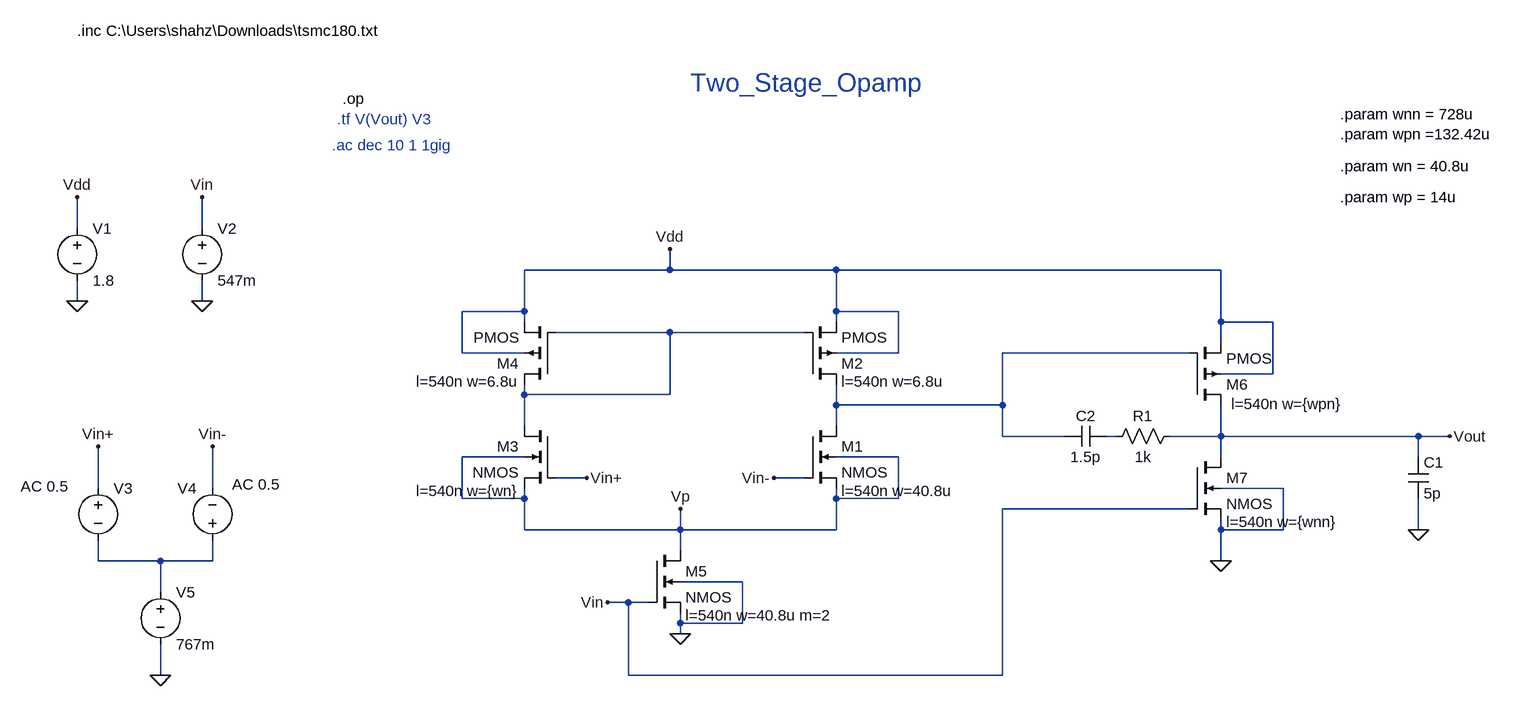
[diagram p0: schematic OpAmp_Core_Circuit.asc]
OpAmp_Core_Circuit.asc, the LTspice schematic file:
Version 4
SHEET 1 1876 936
WIRE -880 -96 -880 -144
WIRE -688 -96 -688 -144
WIRE 32 -32 32 -64
WIRE 32 -32 -192 -32
WIRE 288 -32 32 -32
WIRE 880 -32 288 -32
WIRE -880 16 -880 -16
WIRE -688 16 -688 -16
WIRE -192 32 -192 -32
WIRE -192 32 -288 32
WIRE 288 32 288 -32
WIRE 384 32 288 32
WIRE -192 48 -192 32
WIRE 288 48 288 32
WIRE 880 48 880 -32
WIRE 960 48 880 48
WIRE 32 64 -144 64
WIRE 240 64 32 64
WIRE 880 80 880 48
WIRE -288 96 -288 32
WIRE -192 96 -288 96
WIRE 384 96 384 32
WIRE 384 96 288 96
WIRE 832 96 544 96
WIRE 960 128 960 48
WIRE 960 128 880 128
WIRE -192 160 -192 144
WIRE 32 160 32 64
WIRE 32 160 -192 160
WIRE 288 176 288 144
WIRE 544 176 544 96
WIRE 544 176 288 176
WIRE -192 208 -192 160
WIRE 288 208 288 176
WIRE 544 224 544 176
WIRE 640 224 544 224
WIRE 720 224 704 224
WIRE 880 224 880 176
WIRE 880 224 800 224
WIRE 1184 224 880 224
WIRE 1232 224 1184 224
WIRE -192 256 -288 256
WIRE 384 256 288 256
WIRE 880 256 880 224
WIRE 1184 256 1184 224
WIRE -96 288 -144 288
WIRE 240 288 192 288
WIRE -848 304 -848 240
WIRE -672 304 -672 240
WIRE 976 304 880 304
WIRE -288 320 -288 256
WIRE -192 320 -192 304
WIRE -192 320 -288 320
WIRE 288 320 288 304
WIRE 384 320 384 256
WIRE 384 320 288 320
WIRE 832 336 544 336
WIRE -192 368 -192 320
WIRE 48 368 48 336
WIRE 48 368 -192 368
WIRE 288 368 288 320
WIRE 288 368 48 368
WIRE 880 368 880 352
WIRE 976 368 976 304
WIRE 976 368 880 368
WIRE 1184 368 1184 320
WIRE 48 400 48 368
WIRE -848 416 -848 384
WIRE -752 416 -848 416
WIRE -672 416 -672 384
WIRE -672 416 -752 416
WIRE 880 416 880 368
WIRE 144 448 48 448
WIRE -752 464 -752 416
WIRE -32 480 -64 480
WIRE 0 480 -32 480
WIRE 48 512 48 496
WIRE 144 512 144 448
WIRE 144 512 48 512
WIRE 48 528 48 512
WIRE -752 592 -752 544
WIRE -32 592 -32 480
WIRE 544 592 544 336
WIRE 544 592 -32 592
FLAG 32 -64 Vdd
FLAG 192 288 Vin-
FLAG -96 288 Vin+
FLAG -880 16 0
FLAG -880 -144 Vdd
FLAG -688 16 0
FLAG -688 -144 Vin
FLAG 48 528 0
FLAG -64 480 Vin
FLAG -752 592 0
FLAG -848 240 Vin+
FLAG -672 240 Vin-
FLAG 48 336 Vp
FLAG 880 416 0
FLAG 1232 224 Vout
FLAG 1184 368 0
DATAFLAG 992 224 ""
DATAFLAG 416 176 ""
SYMBOL nmos4 240 208 R0
WINDOW 123 56 100 Left 2
SYMATTR Value2 l=540n w=40.8u
SYMATTR InstName M1
SYMBOL pmos4 240 144 M180
WINDOW 123 56 4 Left 2
SYMATTR Value2 l=540n w=6.8u
SYMATTR InstName M2
SYMBOL nmos4 -144 208 M0
WINDOW 123 56 100 Left 2
SYMATTR Value2 l=540n w={wn}
SYMATTR InstName M3
SYMBOL pmos4 -144 144 R180
WINDOW 123 56 4 Left 2
SYMATTR Value2 l=540n w=6.8u
SYMATTR InstName M4
SYMBOL voltage -880 -112 R0
WINDOW 123 0 0 Left 0
WINDOW 39 0 0 Left 0
SYMATTR InstName V1
SYMATTR Value 1.8
SYMBOL voltage -688 -112 R0
WINDOW 123 24 124 Left 2
WINDOW 39 0 0 Left 0
SYMATTR InstName V2
SYMATTR Value 547m
SYMBOL nmos4 0 400 R0
WINDOW 123 56 100 Left 2
SYMATTR Value2 l=540n w=40.8u m=2
SYMATTR InstName M5
SYMBOL voltage -848 288 R0
WINDOW 123 -119 13 Left 2
WINDOW 39 0 0 Left 0
SYMATTR Value2 AC 0.5
SYMATTR InstName V3
SYMATTR Value ""
SYMBOL voltage -672 400 R180
WINDOW 0 24 96 Left 2
WINDOW 3 24 16 Left 2
WINDOW 123 -104 102 Left 2
WINDOW 39 0 0 Left 0
SYMATTR InstName V4
SYMATTR Value ""
SYMATTR Value2 AC 0.5
SYMBOL voltage -752 448 R0
WINDOW 123 0 0 Left 0
WINDOW 39 0 0 Left 0
SYMATTR InstName V5
SYMATTR Value 767m
SYMBOL pmos4 832 176 M180
WINDOW 123 64 2 Left 2
SYMATTR Value2 l=540n w={wpn}
SYMATTR InstName M6
SYMBOL nmos4 832 256 R0
WINDOW 123 56 100 Left 2
SYMATTR Value2 l=540n w={wnn}
SYMATTR InstName M7
SYMBOL cap 1168 256 R0
SYMATTR InstName C1
SYMATTR Value 5p
SYMBOL cap 704 208 R90
WINDOW 0 0 32 VBottom 2
WINDOW 3 32 32 VTop 2
SYMATTR InstName C2
SYMATTR Value 1.5p
SYMBOL res 816 208 R90
WINDOW 0 0 56 VBottom 2
WINDOW 3 32 56 VTop 2
SYMATTR InstName R1
SYMATTR Value 1k
TEXT -472 -296 Left 2 !.op
TEXT 1064 -144 Left 2 !.param wp = 14u
TEXT 1064 -192 Left 2 !.param wn = 40.8u
TEXT -480 -264 Left 2 ;.tf V(Vout) V3
TEXT -488 -224 Left 2 ;.ac dec 10 1 1gig
TEXT 1064 -272 Left 2 !.param wnn = 728u\n.param wpn =132.42u
TEXT -880 -400 Left 2 !.inc C:\\Users\\shahz\\Downloads\\tsmc180.txt
TEXT 64 -320 Left 4 ;Two_Stage_Opamp

The netlist it stands for:
* OpAmp_Core_Circuit.asc
M1 N002 Vin- Vp Vp NMOS l=540n w=40.8u
M2 N002 N001 Vdd Vdd PMOS l=540n w=6.8u
M3 N001 Vin+ Vp Vp NMOS l=540n w={wn}
M4 N001 N001 Vdd Vdd PMOS l=540n w=6.8u
V1 Vdd 0 1.8
V2 Vin 0 547m
M5 Vp Vin 0 0 NMOS l=540n w=40.8u m=2
V3 Vin+ N004 AC 0.5
V4 N004 Vin- AC 0.5
V5 N004 0 767m
M6 Vout N002 Vdd Vdd PMOS l=540n w={wpn}
M7 Vout Vin 0 0 NMOS l=540n w={wnn}
C1 Vout 0 5p
C2 N003 N002 1.5p
R1 Vout N003 1k
.model NMOS NMOS
.model PMOS PMOS
.lib standard.mos
.op
.param wp = 14u
.param wn = 40.8u
* .tf V(Vout) V3
* .ac dec 10 1 1gig
.param wnn = 728u
.param wpn =132.42u
.inc C:\Users\shahz\Downloads\tsmc180.txt
* Two_Stage_Opamp
.backanno
.end